# EAGLE schematic G0 with UART (EAGLE 9.6.2)
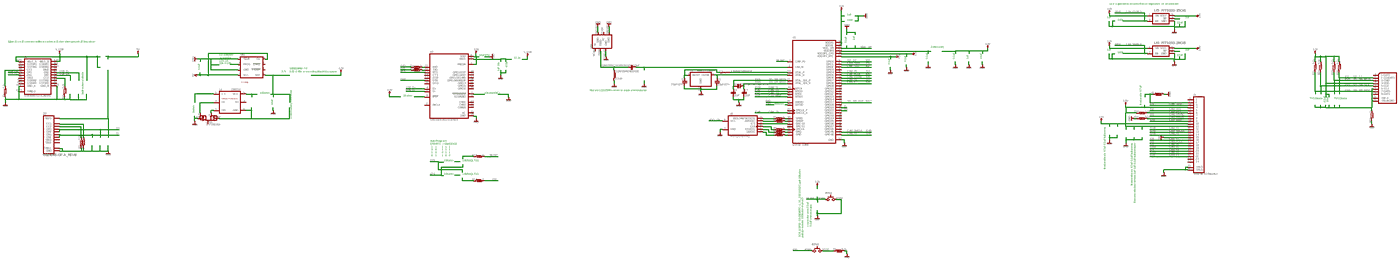
[diagram p0: schematic, sheet 1, overview]
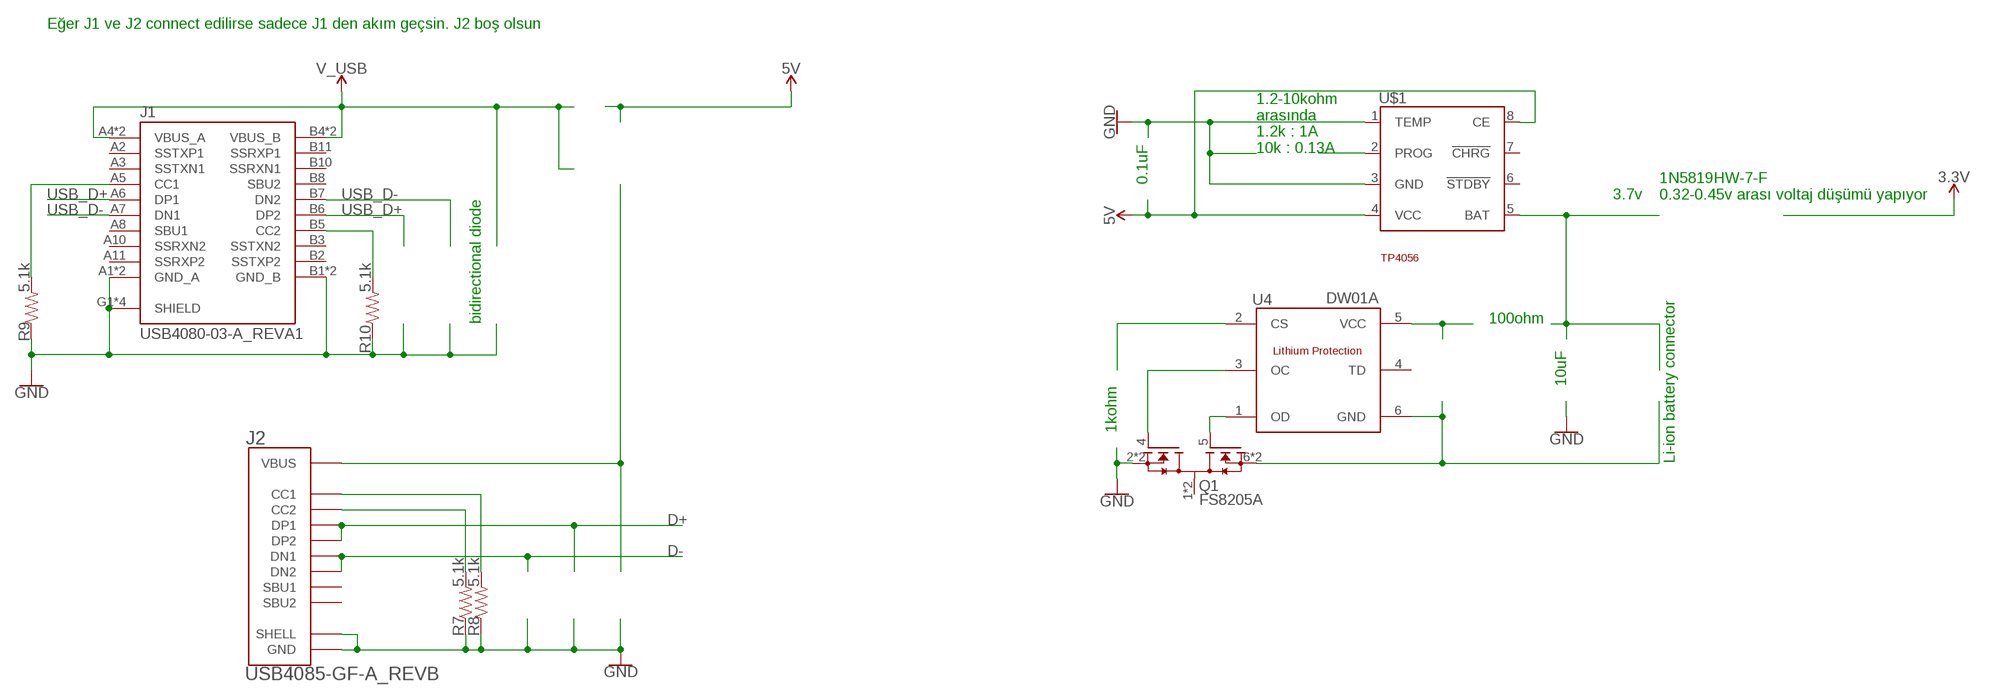
[diagram p1: schematic, sheet 1, part 1 of 4]
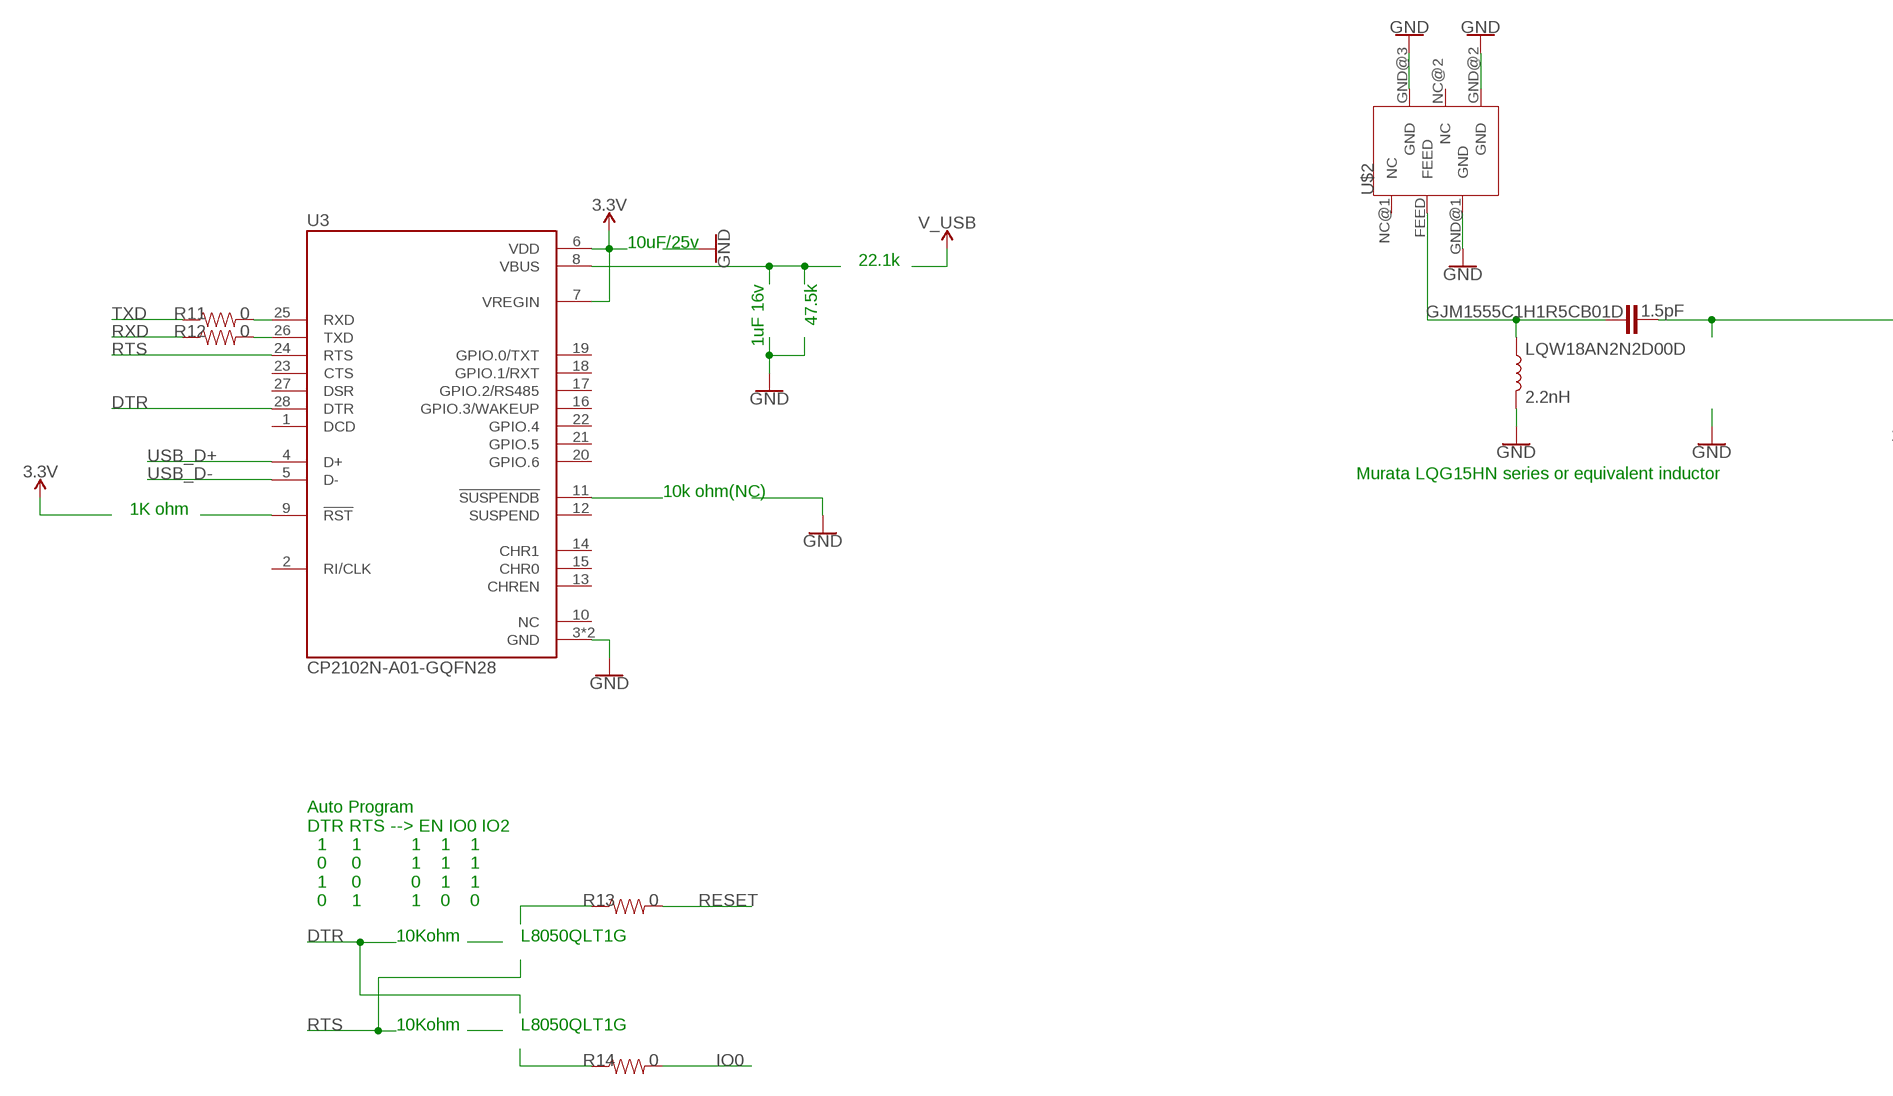
[diagram p2: schematic, sheet 1, part 2 of 4]
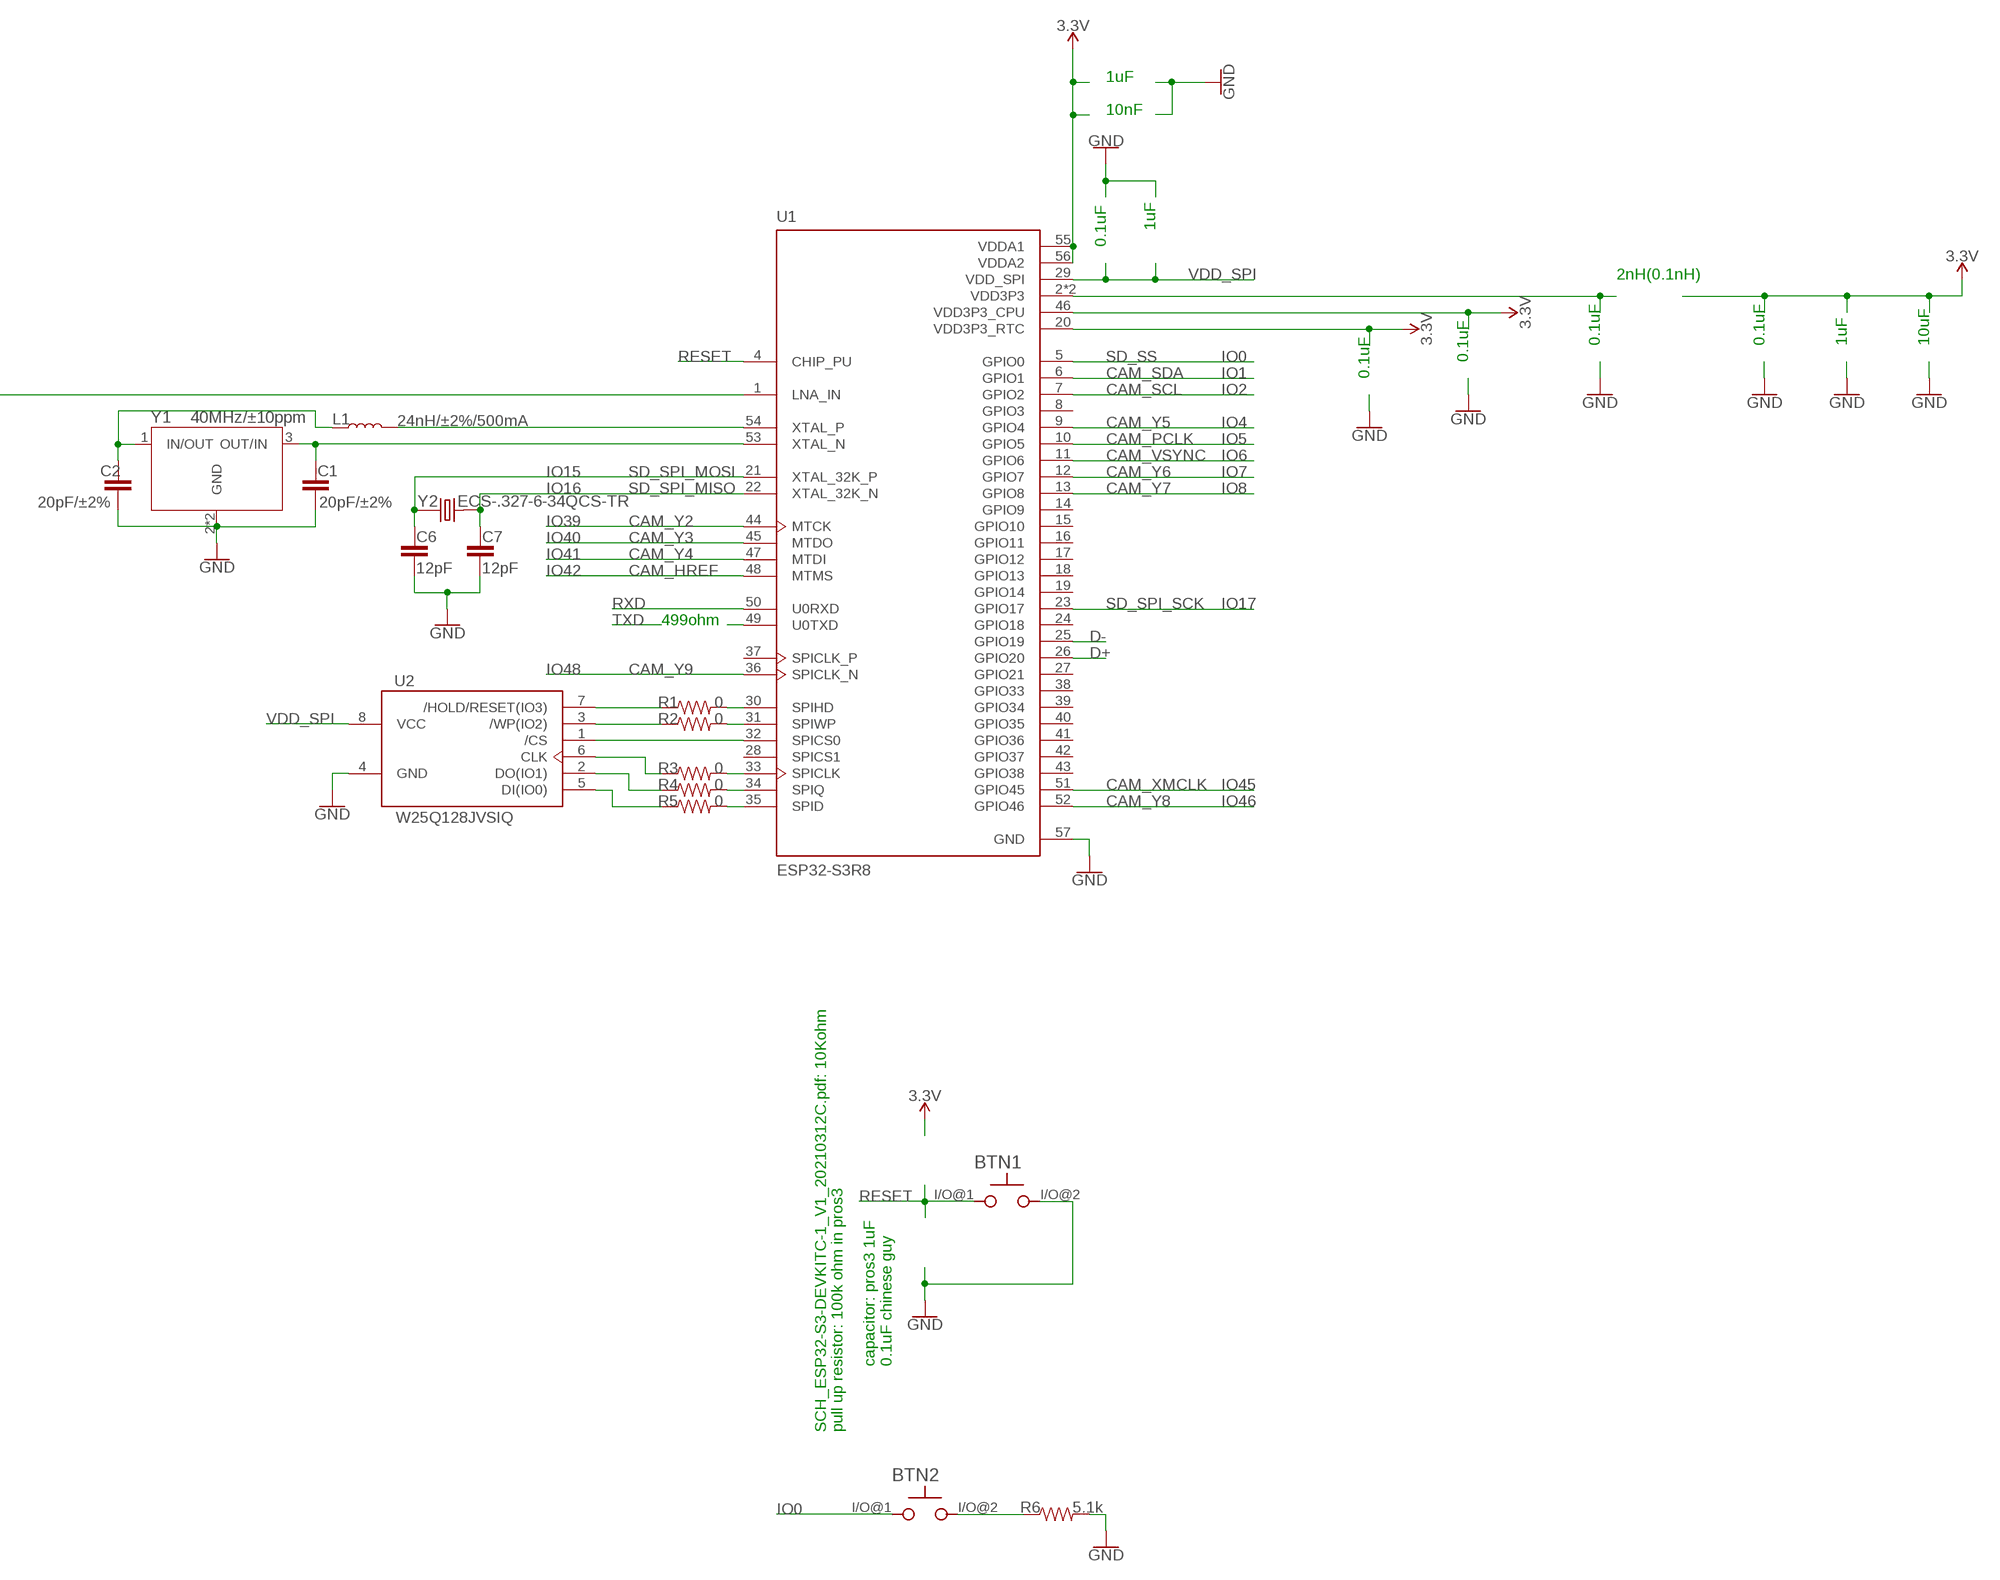
[diagram p3: schematic, sheet 1, part 3 of 4]
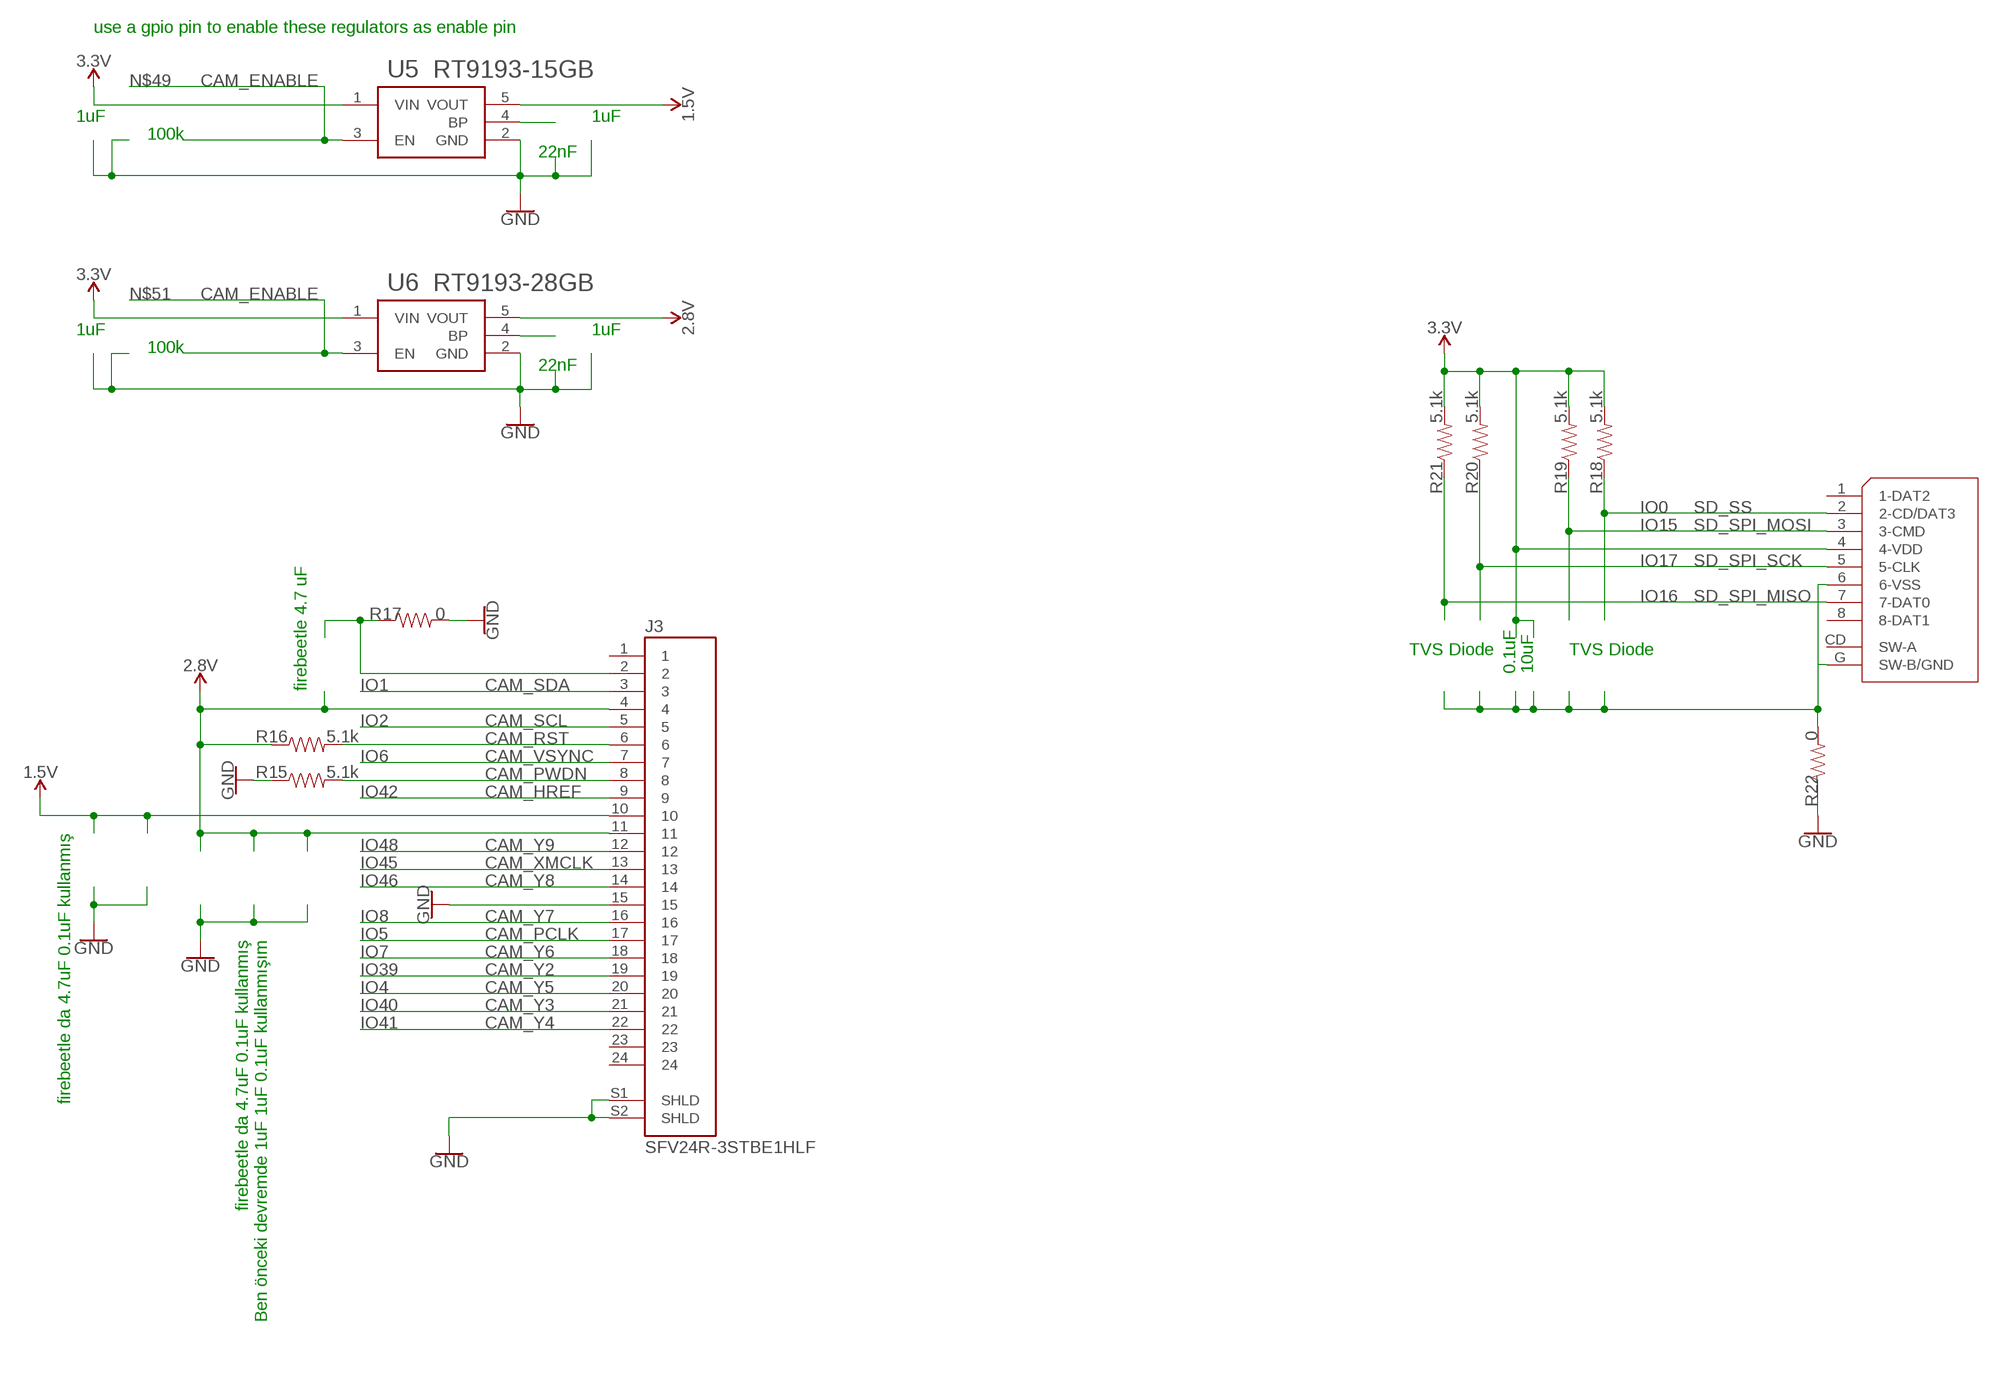
[diagram p4: schematic, sheet 1, part 4 of 4]

## Parts
BTN1  TL3780AF330QG  [TL3780AF330QG]
BTN2  TL3780AF330QG  [TL3780AF330QG]
C1  20pF/±2%  0.1UF-0402-16V-10%  [0402]
C2  20pF/±2%  0.1UF-0402-16V-10%  [0402]
C6  12pF  0.1UF-0402-16V-10%  [0402]
C7  12pF  0.1UF-0402-16V-10%  [0402]
GJM1555C1H1R5CB01D  1.5pF  0.1UF-0402-10V-10%-X7R  [0402]
J1  USB4080-03-A_REVA1  [GCT_USB4080-03-A_REVA1]
J2  USB4085-GF-A_REVB  [GCT_USB4085-GF-A_REVB]
J3  SFV24R-3STBE1HLF  [AMPHENOL_SFV24R-3STBE1HLF]
K1  112J-TDAR-R01  [112J-TDAR-R01]
L1  24nH/±2%/500mA  INDUCTOR-0603-33NH  [0603]
LQW18AN2N2D00D  2.2nH  11NH-0603  [0603_MURATA]
Q1  FS8205A  [SOP65P640X120-8N]
R1  0  0OHM-0603-1/10W  [0603]
R2  0  0OHM-0603-1/10W  [0603]
R3  0  0OHM-0603-1/10W  [0603]
R4  0  0OHM-0603-1/10W  [0603]
R5  0  0OHM-0603-1/10W  [0603]
R6  5.1k  5.1KOHM5.1KOHM-0603-1/10W-1%  [0603]
R7  5.1k  5.1KOHM5.1KOHM-0603-1/10W-1%  [0603]
R8  5.1k  5.1KOHM5.1KOHM-0603-1/10W-1%  [0603]
R9  5.1k  5.1KOHM5.1KOHM-0603-1/10W-1%  [0603]
R10  5.1k  5.1KOHM5.1KOHM-0603-1/10W-1%  [0603]
R11  0  0OHM-0603-1/10W  [0603]
R12  0  0OHM-0603-1/10W  [0603]
R13  0  0OHM-0603-1/10W  [0603]
R14  0  0OHM-0603-1/10W  [0603]
R15  5.1k  5.1KOHM5.1KOHM-0603-1/10W-1%  [0603]
R16  5.1k  5.1KOHM5.1KOHM-0603-1/10W-1%  [0603]
R17  0  0OHM-0603-1/10W  [0603]
R18  5.1k  5.1KOHM5.1KOHM-0603-1/10W-1%  [0603]
R19  5.1k  5.1KOHM5.1KOHM-0603-1/10W-1%  [0603]
R20  5.1k  5.1KOHM5.1KOHM-0603-1/10W-1%  [0603]
R21  5.1k  5.1KOHM5.1KOHM-0603-1/10W-1%  [0603]
R22  0  0OHM-0603-1/10W  [0603]
U1  ESP32-S3R8  ESP32-S3  [IC_ESP32-S3]
U2  W25Q128JVSIQ  [SOIC127P790X216-8N]
U3  CP2102N-A01-GQFN28  [QFN50P500X500X80-29N]
U4  DW01A  [SOT23-6]
U5  RT9193-15GB  RT9193-33GB  [SOT94P279X129-5N]
U6  RT9193-28GB  RT9193-33GB  [SOT94P279X129-5N]
U$1  TP4056  [SOT23-8]
U$2  SR4W035  [SR4W035]
Y1  40MHz/±10ppm  ECS-384-10-37-CKM-TR  [XTAL_ECS-384-10-37-CKM-TR]
Y2  ECS-.327-6-34QCS-TR  [XTAL_ECS-.327-6-34QCS-TR]

## Nets
1.8V: J3.10 U5.5(VOUT) ; supply symbol labelled 1.5V
2.8V: J3.4 J3.11 R16.1 U6.5(VOUT)
3.3V: K1.4(4-VDD) R18.2 R19.2 R20.2 R21.2 U1.20(VDD3P3_RTC) U1.46(VDD3P3_CPU) U1.55(VDDA1) U1.56(VDDA2) U3.6(VDD) U3.7(VREGIN) U5.1(VIN) U6.1(VIN)
5V: U$1.4(VCC) U$1.8(CE)
D+: J2.A6(DP1) J2.B6(DP2) U1.26(GPIO20)
D-: J2.A7(DN1) J2.B7(DN2) U1.25(GPIO19)
DTR: U3.28(DTR)
GND: BTN1.I/O@2(I/O) C1.2 C2.2 C6.2 C7.2 J1.A1(GND_A) J1.A12(GND_A) J1.B1(GND_B) J1.B12(GND_B) J1.G1(SHIELD) J1.G2(SHIELD) J1.G3(SHIELD) J1.G4(SHIELD) J2.A1(GND) J2.A12(GND) J2.B1(GND) J2.B12(GND) J2.S1(SHELL) J2.S2(SHELL) J2.S3(SHELL) J2.S4(SHELL) J3.15 J3.S1(SHLD) J3.S2(SHLD) LQW18AN2N2D00D.P$2 Q1.2(S1) Q1.3(S1) R6.2 R7.1 R8.1 R9.1 R10.1 R15.1 R17.2 R22.1 U1.57(GND) U2.4(GND) U3.3(GND) U3.29(GND) U5.2(GND) U6.2(GND) U$1.1(TEMP) U$1.3(GND) U$2.GND@1(GND) U$2.GND@2(GND) U$2.GND@3(GND) Y1.2(GND) Y1.4(GND)
IO0: BTN2.I/O@1(I/O) K1.2(2-CD/DAT3) R14.2 R18.1 U1.5(GPIO0)
IO1: J3.3 U1.6(GPIO1)
IO2: J3.5 U1.7(GPIO2)
IO4: J3.20 U1.9(GPIO4)
IO5: J3.17 U1.10(GPIO5)
IO6: J3.7 U1.11(GPIO6)
IO7: J3.18 U1.12(GPIO7)
IO8: J3.16 U1.13(GPIO8)
IO15: C6.1 K1.3(3-CMD) R19.1 U1.21(XTAL_32K_P) Y2.1(I/O)
IO16: C7.1 K1.7(7-DAT0) R21.1 U1.22(XTAL_32K_N) Y2.2(O/I)
IO17: K1.5(5-CLK) R20.1 U1.23(GPIO17)
IO39: J3.19 U1.44(MTCK)
IO40: J3.21 U1.45(MTDO)
IO41: J3.22 U1.47(MTDI)
IO42: J3.9 U1.48(MTMS)
IO45: J3.13 U1.51(GPIO45)
IO46: J3.14 U1.52(GPIO46)
IO48: J3.12 U1.36(SPICLK_N)
N$1: U1.32(SPICS0) U2.1(/CS)
N$2: R1.1 U2.7(/HOLD/RESET(IO3))
N$3: R1.2 U1.30(SPIHD)
N$4: R2.1 U2.3(/WP(IO2))
N$5: R2.2 U1.31(SPIWP)
N$6: R3.1 U2.6(CLK)
N$7: R4.1 U2.2(DO(IO1))
N$8: R5.1 U2.5(DI(IO0))
N$9: R3.2 U1.33(SPICLK)
N$10: R4.2 U1.34(SPIQ)
N$11: R5.2 U1.35(SPID)
N$12: L1.2 U1.54(XTAL_P)
N$13: C2.1 L1.1 Y1.1(IN/OUT)
N$14: C1.1 U1.53(XTAL_N) Y1.3(OUT/IN)
N$15: BTN2.I/O@2(I/O) R6.1
N$16: J2.A5(CC1) R8.2
N$17: J2.B5(CC2) R7.2
N$18: J2.A4(VBUS) J2.A9(VBUS) J2.B4(VBUS) J2.B9(VBUS)
N$19: J1.A5(CC1) R9.2
N$20: J1.B5(CC2) R10.2
N$21: R11.2 U3.25(RXD)
N$22: U3.11(!SUSPENDB)
N$23: R12.2 U3.26(TXD)
N$24: U3.9(!RST)
N$25: K1.6(6-VSS) K1.G(SW-B/GND) R22.2
N$26: GJM1555C1H1R5CB01D.1 LQW18AN2N2D00D.P$1 U$2.FEED
N$27: GJM1555C1H1R5CB01D.2 U1.1(LNA_IN)
N$30: U1.2(VDD3P3) U1.3(VDD3P3)
N$31: J3.6 R16.2
N$32: J3.8 R15.2
N$33: U1.49(U0TXD)
N$34: U3.8(VBUS)
N$35: R13.1
N$36: R14.1
N$39: U$1.5(BAT)
N$40: U$1.2(PROG)
N$41: Q1.6(S2) Q1.7(S2) U4.6(GND)
N$42: Q1.4(G1) U4.3(OC)
N$43: Q1.5(G2) U4.1(OD)
N$44: U4.2(CS)
N$45: U4.5(VCC)
N$46: U5.4(BP)
N$47: U6.4(BP)
N$48: J3.2 R17.1
N$49: U5.3(EN)
N$51: U6.3(EN)
RESET: BTN1.I/O@1(I/O) R13.2 U1.4(CHIP_PU)
RTS: U3.24(RTS)
RXD: R12.1 U1.50(U0RXD)
TXD: R11.1
USB_D+: J1.A6(DP1) J1.B6(DP2) U3.4(D+)
USB_D-: J1.A7(DN1) J1.B7(DN2) U3.5(D-)
V_USB: J1.A4(VBUS_A) J1.A9(VBUS_A) J1.B4(VBUS_B) J1.B9(VBUS_B)
VDD_SPI: U1.29(VDD_SPI) U2.8(VCC)
Unconnected: J1.A2(SSTXP1) J1.A3(SSTXN1) J1.A8(SBU1) J1.A10(SSRXN2) J1.A11(SSRXP2) J1.B2(SSTXP2) J1.B3(SSTXN2) J1.B8(SBU2) J1.B10(SSRXN1) J1.B11(SSRXP1) J2.A8(SBU1) J2.B8(SBU2) J3.1 J3.23 J3.24 K1.1(1-DAT2) K1.8(8-DAT1) K1.CD(SW-A) Q1.1(D12) Q1.8(D12) U1.8(GPIO3) U1.14(GPIO9) U1.15(GPIO10) U1.16(GPIO11) U1.17(GPIO12) U1.18(GPIO13) U1.19(GPIO14) U1.24(GPIO18) U1.27(GPIO21) U1.28(SPICS1) U1.37(SPICLK_P) U1.38(GPIO33) U1.39(GPIO34) U1.40(GPIO35) U1.41(GPIO36) U1.42(GPIO37) U1.43(GPIO38) U3.1(DCD) U3.2(RI/CLK) U3.10(NC) U3.12(SUSPEND) U3.13(CHREN) U3.14(CHR1) U3.15(CHR0) U3.16(GPIO.3/WAKEUP) U3.17(GPIO.2/RS485) U3.18(GPIO.1/RXT) U3.19(GPIO.0/TXT) U3.20(GPIO.6) U3.21(GPIO.5) U3.22(GPIO.4) U3.23(CTS) U3.27(DSR) U4.4(TD) U$1.6(!STDBY) U$1.7(!CHRG) U$2.NC@1(NC) U$2.NC@2(NC)

## Notes on the sheet
- use a gpio pin to enable these regulators as enable pin
- CAM_ENABLE
- 1uF
- 1uF | 1uF
- 10nF | 100k
- 22nF
- 1uF
- Eğer J1 ve J2 connect edilirse sadece J1 den akım geçsin. J2 boş olsun | 0.1uF
- CAM_ENABLE
- 2nH(0.1nH)
- 1uF | 1uF
- 100k
- 10uF/25v | 22nF
- 22.1k | 0.1uF | 0.1uF | 1uF | 10uF
- 1uF 16v | 47.5k | SD_SS | 0.1uF
- 1.2-10kohm
  arasında
  1.2k : 1A
  10k : 0.13A
- CAM_SDA | 0.1uF
- CAM_SCL
- 0.1uF
- 3.7v
- 1N5819HW-7-F
  0.32-0.45v arası voltaj düşümü yapıyor
- CAM_Y5
- CAM_PCLK
- CAM_VSYNC | SD_SS
- SD_SPI_MOSI | CAM_Y6 | SD_SPI_MOSI
- SD_SPI_MISO | CAM_Y7
- SD_SPI_SCK
- CAM_Y2
- Murata LQG15HN series or equivalent inductor | CAM_Y3 | SD_SPI_MISO
- bidirectional diode | 100ohm | 10k ohm(NC) | CAM_Y4
- 1K ohm | CAM_HREF
- TVS Diode | TVS Diode
- SD_SPI_SCK | 0.1uF | 10uF
- 10uF | 499ohm | firebeetle 4.7 uF | CAM_SDA
- CAM_SCL
- 1kohm | CAM_Y9 | CAM_RST
- CAM_VSYNC
- Li-ion battery connector | CAM_PWDN
- CAM_HREF
- firebeetle da 4.7uF 0.1uF kullanmış
- CAM_Y9
- CAM_XMCLK | CAM_XMCLK
- CAM_Y8 | CAM_Y8
- CAM_Y7
- firebeetle da 4.7uF 0.1uF kullanmış
  Ben önceki devremde 1uF 1uF 0.1uF kullanmışım
- CAM_PCLK
- CAM_Y6
- CAM_Y2
- CAM_Y5
- CAM_Y3
- Auto Program
  DTR RTS --> EN IO0 IO2
    1     1          1    1    1
    0     0          1    1    1
    1     0          0    1    1
    0     1          1    0    0
- CAM_Y4
- 10Kohm | L8050QLT1G
- 10Kohm | L8050QLT1G
- capacitor: pros3 1uF
  0.1uF chinese guy
- SCH_ESP32-S3-DEVKITC-1_V1_20210312C.pdf: 10Kohm | pull up resistor: 100k ohm in pros3

## Library data of the parts
BTN1 BTN2 = TL3780AF330QG:TL3780AF330QG
C1 C2 C6 C7 = SparkFun-Capacitors:0.1UF: 0.1µF ceramic capacitors A capacitor is a passive two-terminal electrical component used to store electrical energy temporarily in an electric field.; PROD_ID: CAP-12416; VALUE: 0.1uF
GJM1555C1H1R5CB01D = SparkFun-Capacitors:0.1UF: 0.1µF ceramic capacitors A capacitor is a passive two-terminal electrical component used to store electrical energy temporarily in an electric field.; PROD_ID: CAP-15083; VALUE: 0.1uF
J1 = USB4080-03-A_REVA1:USB4080-03-A_REVA1: Check availability <https://pricing.snapeda.com/parts/USB4080-03-A/Global%20Connector%20Technology/view-part?ref=eda>; AVAILABILITY: In Stock; CHECK_PRICES: https://www.snapeda.com/parts/USB4080-03-A/Global+Connector+Technology/view-part/?ref=eda; DESCRIPTION: USB-C (USB TYPE-C) USB 3.2 Gen 2 (USB 3.1 Gen 2, Superspeed + (USB 3.1)) Receptacle Connector 24 Position Surface Mount, Right Angle; Through Hole; MF: Global Connector Technology; MP: USB4080-03-A; PACKAGE: None; PRICE: None; PURCHASE-URL: https://www.snapeda.com/api/url_track_click_mouser/?unipart_id=6227017&manufacturer=Global Connector Technology&part_name=USB4080-03-A&search_term=None; SNAPEDA_LINK: https://www.snapeda.com/parts/USB4080-03-A/Global+Connector+Technology/view-part/?ref=snap
J2 = USB4085-GF-A_REVB:USB4085-GF-A_REVB: Check availability <https://pricing.snapeda.com/parts/USB4085-GF-A/Global%20Connector%20Technology/view-part?ref=eda>; AVAILABILITY: In Stock; CHECK_PRICES: https://www.snapeda.com/parts/USB4085-GF-A/Global+Connector+Technology/view-part/?ref=eda; DESCRIPTION: USB-C (USB TYPE-C) USB 2.0 Receptacle Connector 24 (16+8 Dummy) Position Through Hole, Right Angle, low cost, 3.46mm profile, 16 pin, horizontal, Top mount; MF: Global Connector Technology; MP: USB4085-GF-A; PACKAGE: None; PRICE: None; PURCHASE-URL: https://www.snapeda.com/api/url_track_click_mouser/?unipart_id=2780390&manufacturer=Global Connector Technology&part_name=USB4085-GF-A&search_term=None; SNAPEDA_LINK: https://www.snapeda.com/parts/USB4085-GF-A/Global+Connector+Technology/view-part/?ref=snap
J3 = SFV24R-3STBE1HLF:SFV24R-3STBE1HLF: Check availability <https://pricing.snapeda.com/parts/SFV24R-3STBE1HLF/Amphenol/view-part?ref=eda>; AVAILABILITY: In Stock; CHECK_PRICES: https://www.snapeda.com/parts/SFV24R-3STBE1HLF/Amphenol/view-part/?ref=eda; DESCRIPTION: 0.50mm Flex Connector, SFV-R Series, 24 Position, Bottom Side Contact, Side Entry Surface Mount ZIF Connector, Halogen Free, Lead Free with Cable-Lock, Gold Flash.; MF: Amphenol; MP: SFV24R-3STBE1HLF; PACKAGE: None; PRICE: None; PURCHASE-URL: https://www.snapeda.com/api/url_track_click_mouser/?unipart_id=13564515&manufacturer=Amphenol&part_name=SFV24R-3STBE1HLF&search_term=None; SNAPEDA_LINK: https://www.snapeda.com/parts/SFV24R-3STBE1HLF/Amphenol/view-part/?ref=snap
K1 = 112J-TDAR-R01:112J-TDAR-R01: Check availability <https://pricing.snapeda.com/parts/112J-TDAR-R01/Attend/view-part?ref=eda>; AVAILABILITY: In Stock; CHECK_PRICES: https://www.snapeda.com/parts/112J-TDAR-R01/Attend/view-part/?ref=eda; DESCRIPTION: 9 (8 + 1) Position Card Connector Secure Digital - microSD™ Surface Mount, Right Angle Gold; MF: Attend; MP: 112J-TDAR-R01; PACKAGE: None; PRICE: None; SNAPEDA_LINK: https://www.snapeda.com/parts/112J-TDAR-R01/Attend/view-part/?ref=snap
L1 = SparkFun-Coils:INDUCTOR: Inductors Resist changes in electrical current. Basically a coil of wire. SparkFun Products: SparkFun Load Cell Amplifier - HX711 <https://www.sparkfun.com/products/13879> IOIO-OTG - V2.2 <https://www.sparkfun.com/products/13613>; PROD_ID: NDUC-07874; VALUE: 33nH/±5%/500mA
LQW18AN2N2D00D = SparkFun-Coils:11NH; PROD_ID: NDUC-14354; VALUE: 11 nH
Q1 = FS8205A:FS8205A: N/A Check availability <https://pricing.snapeda.com/parts/FS8205A/Fortune%20Semiconductor/view-part?ref=eda>; AVAILABILITY: Not in stock; CHECK_PRICES: https://www.snapeda.com/parts/FS8205A/Fortune+Semiconductor/view-part/?ref=eda; MF: Fortune Semiconductor; MP: FS8205A; PACKAGE: Package; PRICE: None; SNAPEDA_LINK: https://www.snapeda.com/parts/FS8205A/Fortune+Semiconductor/view-part/?ref=snap
R1-R5 R11-R14 R17 R22 = SparkFun-Resistors:0OHM: 0Ω resistor A resistor is a passive two-terminal electrical component that implements electrical resistance as a circuit element. Resistors act to reduce current flow, and, at the same time, act to lower voltage levels within circuits. - Wikipedia; PROD_ID: RES-08609
R6-R10 R15 R16 R18-R21 = SparkFun-Resistors:5.1KOHM; PROD_ID: RES-12083
U1 = ESP32-S3:ESP32-S3: Check availability <https://pricing.snapeda.com/parts/ESP32-S3/Espressif%20Systems/view-part?ref=eda>; AVAILABILITY: In Stock; CHECK_PRICES: https://www.snapeda.com/parts/ESP32-S3/Espressif+Systems/view-part/?ref=eda; DESCRIPTION: IC RF TxRx + MCU Bluetooth, WiFi 802.11b/g/n, Bluetooth v5.0 2.412GHz ~ 2.484GHz 56-VFQFN Exposed Pad; MF: Espressif Systems; MP: ESP32-S3; PACKAGE: None; PRICE: None; SNAPEDA_LINK: https://www.snapeda.com/parts/ESP32-S3/Espressif+Systems/view-part/?ref=snap
U2 = W25Q128JVSIQ:W25Q128JVSIQ: Check availability <https://pricing.snapeda.com/parts/W25Q128JVSIQ/Winbond%20Electronics/view-part?ref=eda>; AVAILABILITY: In Stock; CHECK_PRICES: https://www.snapeda.com/parts/W25Q128JVSIQ/Winbond+Electronics/view-part/?ref=eda; DESCRIPTION: FLASH - NOR Memory IC 128Mb (16M x 8) SPI - Quad I/O, QPI, DTR 133 MHz 8-SOIC; MF: Winbond Electronics; MP: W25Q128JVSIQ; PACKAGE: SOIC-8 Winbond Electronics; PRICE: None; PURCHASE-URL: https://www.snapeda.com/api/url_track_click_mouser/?unipart_id=1054022&manufacturer=Winbond Electronics&part_name=W25Q128JVSIQ&search_term=None; SNAPEDA_LINK: https://www.snapeda.com/parts/W25Q128JVSIQ/Winbond+Electronics/view-part/?ref=snap
U3 = CP2102N-A01-GQFN28:CP2102N-A01-GQFN28: USB Bridge, USB to UART USB 2.0 UART Interface 28-QFN (5x5) Check availability <https://pricing.snapeda.com/parts/CP2102N-A01-GQFN28/Silicon%20Labs/view-part?ref=eda>; AVAILABILITY: In Stock; CHECK_PRICES: https://www.snapeda.com/parts/CP2102N-A01-GQFN28/Silicon+Labs/view-part/?ref=eda; DESCRIPTION: USB Bridge, USB to UART USB 2.0 UART Interface 28-QFN (5x5); MF: Silicon Labs; MP: CP2102N-A01-GQFN28; PACKAGE: QFN-28 Silicon Labs; PRICE: None; SNAPEDA_LINK: https://www.snapeda.com/parts/CP2102N-A01-GQFN28/Silicon+Labs/view-part/?ref=snap
U4 = DW01A:DW01A: The DW01A battery protection IC is designed to protect lithium-ion/polymer battery from damage or degrading the lifetime due to overcharge, overdischarge, and/or overcurrent for one-cell lithium-ion/polymer battery powered systems, such as cellular phones. Check availability <https://pricing.snapeda.com/parts/DW01A/Fortune%20Semiconductor/view-part?ref=eda>; AVAILABILITY: Not in stock; CHECK_PRICES: https://www.snapeda.com/parts/DW01A/Fortune+Semiconductor/view-part/?ref=eda; DESCRIPTION: One Cell Lithium-ion/Polymer Battery Protection IC; MF: Fortune Semiconductor; MP: DW01A; PACKAGE: SOT-23-6 Fortune Semiconductor; PRICE: None; SNAPEDA_LINK: https://www.snapeda.com/parts/DW01A/Fortune+Semiconductor/view-part/?ref=snap
U5 U6 = RT9193:RT9193-33GB: RT9193 Series 300 mA 3.3 V Ultra-Low Noise Ultra-Fast CMOS LDO Regulator-SC-70-5 Check availability <https://pricing.snapeda.com/parts/RT9193-33GB/Richtek%20USA/view-part?ref=eda>; AVAILABILITY: In Stock; CHECK_PRICES: https://www.snapeda.com/parts/RT9193-33GB/Richtek+USA+Inc./view-part/?ref=eda; DESCRIPTION: Linear Voltage Regulator IC Positive Fixed 1 Output 300mA TSOT-23-5; MF: Richtek USA; MP: RT9193-33GB; PACKAGE: SOT-23-5 Richtek; PRICE: None; PURCHASE-URL: https://www.snapeda.com/api/url_track_click_mouser/?unipart_id=55570&manufacturer=Richtek USA&part_name=RT9193-33GB&search_term=None; SNAPEDA_LINK: https://www.snapeda.com/parts/RT9193-33GB/Richtek+USA+Inc./view-part/?ref=snap
U$1 = TP4056:TP4056: TP4056 Data sheet <http://goo.gl/J7k8TF> Dave.Calaway Eagle Library <https://goo.gl/Muy1Tr>
U$2 = SR4W035:SR4W035
Y1 = ECS-384-10-37-CKM-TR:ECS-384-10-37-CKM-TR: SMD Crystal 2.0 x 1.6 x 0.45 mm ceramic package Check availability <https://pricing.snapeda.com/parts/ECS-384-10-37-CKM-TR/ECS%20Inc./view-part?ref=eda>; AVAILABILITY: In Stock; CHECK_PRICES: https://www.snapeda.com/parts/ECS-384-10-37-CKM-TR/ECS+Inc./view-part/?ref=eda; DESCRIPTION: 38.4 MHz ±10ppm Crystal 10pF 60 Ohms 4-SMD, No Lead; MF: ECS Inc.; MP: ECS-384-10-37-CKM-TR; PACKAGE: SMD-4 ECS Inc.; PRICE: None; PURCHASE-URL: https://www.snapeda.com/api/url_track_click_mouser/?unipart_id=2122327&manufacturer=ECS Inc.&part_name=ECS-384-10-37-CKM-TR&search_term=None; SNAPEDA_LINK: https://www.snapeda.com/parts/ECS-384-10-37-CKM-TR/ECS+Inc./view-part/?ref=snap
Y2 = ECS-.327-6-34QCS-TR:ECS-.327-6-34QCS-TR: The ECX-34Q is a very compact SMD Tuning Fork Crystal with a 3.2 x 1.5 mm footprint Check availability <https://pricing.snapeda.com/parts/ECS-.327-6-34QCS-TR/ECS%20Inc./view-part?ref=eda>; AVAILABILITY: In Stock; CHECK_PRICES: https://www.snapeda.com/parts/ECS-.327-6-34QCS-TR/ECS+Inc./view-part/?ref=eda; DESCRIPTION: 32.768 kHz ±10ppm Crystal 6pF 70 kOhms 2-SMD, No Lead; MF: ECS Inc.; MP: ECS-.327-6-34QCS-TR; PACKAGE: SMD-2 ECS International; PRICE: None; PURCHASE-URL: https://www.snapeda.com/api/url_track_click_mouser/?unipart_id=2456560&manufacturer=ECS Inc.&part_name=ECS-.327-6-34QCS-TR&search_term=None; SNAPEDA_LINK: https://www.snapeda.com/parts/ECS-.327-6-34QCS-TR/ECS+Inc./view-part/?ref=snap